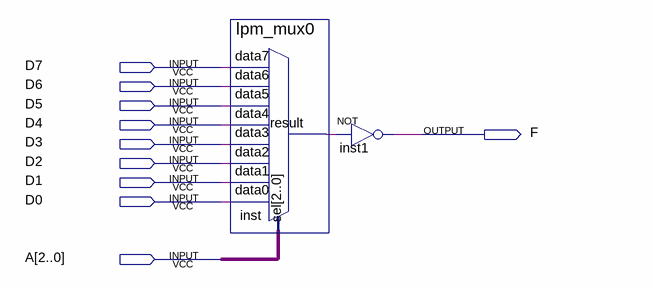
[diagram p0: schematic sheet]
// Quartus schematic lab23.bdf as structural Verilog: 2 symbols, 10 pins
module lab23 (
  input  D7,
  input  D6,
  input  D5,
  input  D4,
  input  D3,
  input  D2,
  input  D1,
  input  D0,
  input  [2:0] A,
  output F
);

  wire inst_result;

  lpm_mux0 inst (
    .data7(D7), .data6(D6), .data5(D5), .data4(D4), .data3(D3), .data2(D2), .data1(D1), .data0(D0), .sel(A),
    .result(inst_result));
  not inst1 (F, inst_result);
endmodule
